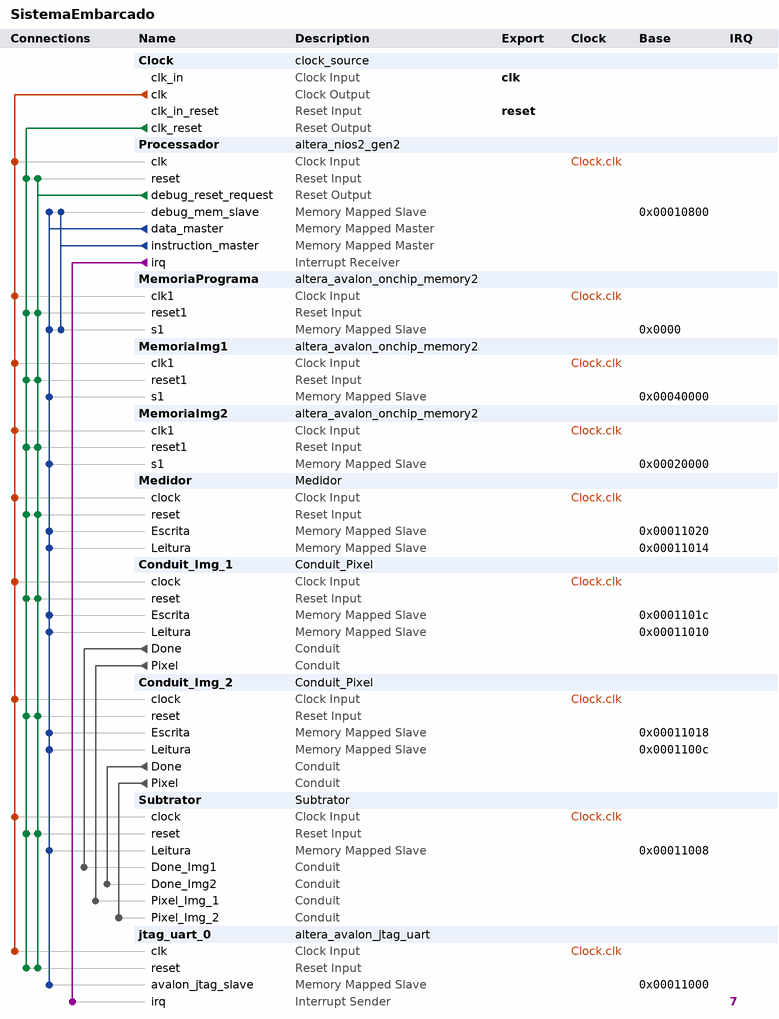
[diagram p0: system contents]
# Platform Designer (Qsys) system SistemaEmbarcado, Cyclone IV E EP4CE115F29C7
# Parameters at their usual value, and those the tool derives, are not listed.
package require -exact qsys 18.1
create_system SistemaEmbarcado
set_project_property DEVICE_FAMILY {Cyclone IV E}
set_project_property DEVICE EP4CE115F29C7

add_instance Clock clock_source 18.1
set_instance_parameter_value Clock clockFrequency 50000000

add_instance Processador altera_nios2_gen2 18.1
set_instance_parameter_value Processador dcache_size 2048
set_instance_parameter_value Processador exceptionSlave MemoriaPrograma.s1
set_instance_parameter_value Processador icache_size 4096
set_instance_parameter_value Processador impl Tiny
set_instance_parameter_value Processador resetSlave MemoriaPrograma.s1

add_instance MemoriaPrograma altera_avalon_onchip_memory2 18.1
set_instance_parameter_value MemoriaPrograma dataWidth 32
set_instance_parameter_value MemoriaPrograma dualPort false
set_instance_parameter_value MemoriaPrograma initMemContent true
set_instance_parameter_value MemoriaPrograma initializationFileName onchip_mem.hex
set_instance_parameter_value MemoriaPrograma memorySize 65536

add_instance MemoriaImg1 altera_avalon_onchip_memory2 18.1
set_instance_parameter_value MemoriaImg1 dataWidth 8
set_instance_parameter_value MemoriaImg1 dualPort false
set_instance_parameter_value MemoriaImg1 initMemContent true
set_instance_parameter_value MemoriaImg1 initializationFileName D:/Documents/quartusIIdata/TesteSubtrator/imagem1.mif
set_instance_parameter_value MemoriaImg1 memorySize 81920
set_instance_parameter_value MemoriaImg1 useNonDefaultInitFile true
set_instance_parameter_value MemoriaImg1 writable false

add_instance MemoriaImg2 altera_avalon_onchip_memory2 18.1
set_instance_parameter_value MemoriaImg2 dataWidth 8
set_instance_parameter_value MemoriaImg2 dualPort false
set_instance_parameter_value MemoriaImg2 initMemContent true
set_instance_parameter_value MemoriaImg2 initializationFileName D:/Documents/quartusIIdata/TesteSubtrator/imagem2.mif
set_instance_parameter_value MemoriaImg2 memorySize 81920
set_instance_parameter_value MemoriaImg2 useNonDefaultInitFile true
set_instance_parameter_value MemoriaImg2 writable false

add_instance Medidor Medidor 1.0

add_instance Conduit_Img_1 Conduit_Pixel 1.0

add_instance Conduit_Img_2 Conduit_Pixel 1.0

add_instance Subtrator Subtrator 1.0

add_instance jtag_uart_0 altera_avalon_jtag_uart 18.1
set_instance_parameter_value jtag_uart_0 simInteractiveOptions NO_INTERACTIVE_WINDOWS

# connections
add_connection Clock.clk Conduit_Img_1.clock clock
add_connection Clock.clk Conduit_Img_2.clock clock
add_connection Clock.clk jtag_uart_0.clk clock
add_connection Clock.clk Medidor.clock clock
add_connection Clock.clk MemoriaImg1.clk1 clock
add_connection Clock.clk MemoriaImg2.clk1 clock
add_connection Clock.clk MemoriaPrograma.clk1 clock
add_connection Clock.clk Processador.clk clock
add_connection Clock.clk Subtrator.clock clock
add_connection Clock.clk_reset Conduit_Img_1.reset reset
add_connection Clock.clk_reset Conduit_Img_2.reset reset
add_connection Clock.clk_reset jtag_uart_0.reset reset
add_connection Clock.clk_reset Medidor.reset reset
add_connection Clock.clk_reset MemoriaImg1.reset1 reset
add_connection Clock.clk_reset MemoriaImg2.reset1 reset
add_connection Clock.clk_reset MemoriaPrograma.reset1 reset
add_connection Clock.clk_reset Processador.reset reset
add_connection Clock.clk_reset Subtrator.reset reset
add_connection Processador.debug_reset_request Conduit_Img_1.reset reset
add_connection Processador.debug_reset_request Conduit_Img_2.reset reset
add_connection Processador.debug_reset_request jtag_uart_0.reset reset
add_connection Processador.debug_reset_request Medidor.reset reset
add_connection Processador.debug_reset_request MemoriaImg1.reset1 reset
add_connection Processador.debug_reset_request MemoriaImg2.reset1 reset
add_connection Processador.debug_reset_request MemoriaPrograma.reset1 reset
add_connection Processador.debug_reset_request Processador.reset reset
add_connection Processador.debug_reset_request Subtrator.reset reset
add_connection Processador.data_master Conduit_Img_1.Escrita avalon
set_connection_parameter_value Processador.data_master/Conduit_Img_1.Escrita baseAddress 0x0001101c
add_connection Processador.data_master Conduit_Img_1.Leitura avalon
set_connection_parameter_value Processador.data_master/Conduit_Img_1.Leitura baseAddress 0x00011010
add_connection Processador.data_master Conduit_Img_2.Escrita avalon
set_connection_parameter_value Processador.data_master/Conduit_Img_2.Escrita baseAddress 0x00011018
add_connection Processador.data_master Conduit_Img_2.Leitura avalon
set_connection_parameter_value Processador.data_master/Conduit_Img_2.Leitura baseAddress 0x0001100c
add_connection Processador.data_master jtag_uart_0.avalon_jtag_slave avalon
set_connection_parameter_value Processador.data_master/jtag_uart_0.avalon_jtag_slave baseAddress 0x00011000
add_connection Processador.data_master Medidor.Escrita avalon
set_connection_parameter_value Processador.data_master/Medidor.Escrita baseAddress 0x00011020
add_connection Processador.data_master Medidor.Leitura avalon
set_connection_parameter_value Processador.data_master/Medidor.Leitura baseAddress 0x00011014
add_connection Processador.data_master MemoriaImg1.s1 avalon
set_connection_parameter_value Processador.data_master/MemoriaImg1.s1 baseAddress 0x00040000
add_connection Processador.data_master MemoriaImg2.s1 avalon
set_connection_parameter_value Processador.data_master/MemoriaImg2.s1 baseAddress 0x00020000
add_connection Processador.data_master MemoriaPrograma.s1 avalon
set_connection_parameter_value Processador.data_master/MemoriaPrograma.s1 baseAddress 0x0000
add_connection Processador.data_master Processador.debug_mem_slave avalon
set_connection_parameter_value Processador.data_master/Processador.debug_mem_slave baseAddress 0x00010800
add_connection Processador.data_master Subtrator.Leitura avalon
set_connection_parameter_value Processador.data_master/Subtrator.Leitura baseAddress 0x00011008
add_connection Processador.instruction_master MemoriaPrograma.s1 avalon
set_connection_parameter_value Processador.instruction_master/MemoriaPrograma.s1 baseAddress 0x0000
add_connection Processador.instruction_master Processador.debug_mem_slave avalon
set_connection_parameter_value Processador.instruction_master/Processador.debug_mem_slave baseAddress 0x00010800
add_connection Conduit_Img_1.Done Subtrator.Done_Img1 conduit
add_connection Conduit_Img_1.Pixel Subtrator.Pixel_Img_1 conduit
add_connection Conduit_Img_2.Done Subtrator.Done_Img2 conduit
add_connection Conduit_Img_2.Pixel Subtrator.Pixel_Img_2 conduit
add_connection Processador.irq jtag_uart_0.irq interrupt
set_connection_parameter_value Processador.irq/jtag_uart_0.irq irqNumber 7

# exported interfaces
add_interface clk clock sink
set_interface_property clk EXPORT_OF Clock.clk_in
add_interface reset reset sink
set_interface_property reset EXPORT_OF Clock.clk_in_reset

set_interconnect_requirement {$system} qsys_mm.clockCrossingAdapter HANDSHAKE
set_interconnect_requirement {$system} qsys_mm.enableEccProtection FALSE
set_interconnect_requirement {$system} qsys_mm.insertDefaultSlave FALSE
set_interconnect_requirement {$system} qsys_mm.maxAdditionalLatency 1

save_system SistemaEmbarcado.qsys
